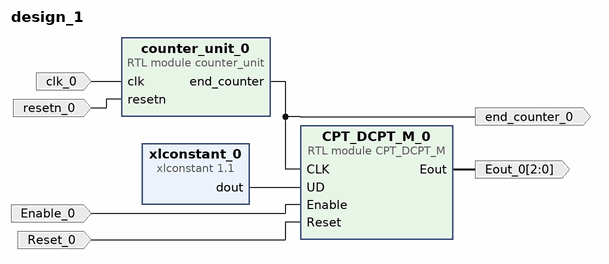
[diagram p0: block diagram of the top level]
# Vivado block design design_1, xc7z010clg400-1, Vivado 2024.1
create_bd_design design_1

create_bd_port -dir I -type clk clk_0
create_bd_port -dir I Enable_0
create_bd_port -dir O -from 2 -to 0 Eout_0
create_bd_port -dir I -type rst Reset_0
create_bd_port -dir I -type rst resetn_0
create_bd_port -dir O end_counter_0

create_bd_cell -type module -reference CPT_DCPT_M CPT_DCPT_M_0
set_property -dict {CONFIG.M 3} [get_bd_cells CPT_DCPT_M_0]
create_bd_cell -type ip -vlnv xilinx.com:ip:xlconstant:1.1 xlconstant_0
set_property -dict {CONFIG.CONST_VAL 0} [get_bd_cells xlconstant_0]
create_bd_cell -type module -reference counter_unit counter_unit_0
set_property -dict {CONFIG.max 100000000 CONFIG.maxb 27} [get_bd_cells counter_unit_0]

# ---- connections ----

connect_bd_net [get_bd_pins CPT_DCPT_M_0/Eout] [get_bd_ports Eout_0]
connect_bd_net -net Enable_0_1 [get_bd_ports Enable_0] [get_bd_pins CPT_DCPT_M_0/Enable]
connect_bd_net -net Reset_0_1 [get_bd_ports Reset_0] [get_bd_pins CPT_DCPT_M_0/Reset]
connect_bd_net -net clk_0_1 [get_bd_ports clk_0] [get_bd_pins counter_unit_0/clk]
connect_bd_net [get_bd_pins counter_unit_0/end_counter] [get_bd_ports end_counter_0] [get_bd_pins CPT_DCPT_M_0/CLK]
connect_bd_net -net resetn_0_1 [get_bd_ports resetn_0] [get_bd_pins counter_unit_0/resetn]
connect_bd_net [get_bd_pins xlconstant_0/dout] [get_bd_pins CPT_DCPT_M_0/UD]

validate_bd_design
save_bd_design
